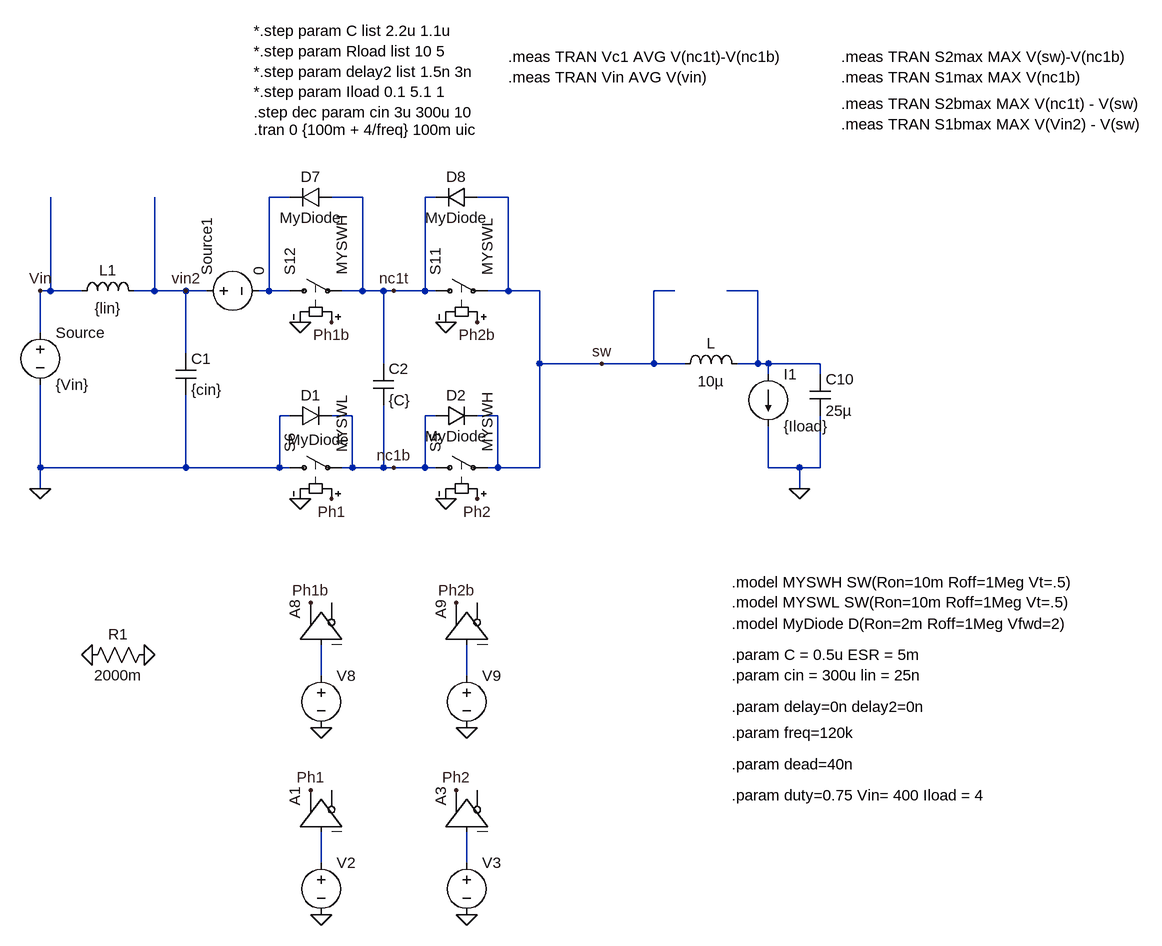
[diagram p0: schematic 3level_input_cap.asc]
3level_input_cap.asc, the LTspice schematic file:
Version 4
SHEET 1 1904 1428
WIRE -1152 -64 -1184 -64
WIRE -1040 -64 -1088 -64
WIRE -928 -64 -944 -64
WIRE -816 -64 -864 -64
WIRE -1520 80 -1520 -64
WIRE -1520 80 -1536 80
WIRE -1472 80 -1520 80
WIRE -1360 80 -1360 -64
WIRE -1360 80 -1392 80
WIRE -1312 80 -1360 80
WIRE -1280 80 -1312 80
WIRE -1184 80 -1184 -64
WIRE -1184 80 -1200 80
WIRE -1152 80 -1184 80
WIRE -1040 80 -1040 -64
WIRE -1040 80 -1072 80
WIRE -1008 80 -1040 80
WIRE -992 80 -1008 80
WIRE -944 80 -944 -64
WIRE -944 80 -992 80
WIRE -928 80 -944 80
WIRE -816 80 -816 -64
WIRE -816 80 -848 80
WIRE -768 80 -816 80
WIRE -560 80 -592 80
WIRE -432 80 -480 80
WIRE -1536 144 -1536 80
WIRE -1312 176 -1312 80
WIRE -1008 192 -1008 80
WIRE -768 192 -768 80
WIRE -672 192 -768 192
WIRE -592 192 -592 80
WIRE -592 192 -672 192
WIRE -544 192 -592 192
WIRE -432 192 -432 80
WIRE -432 192 -464 192
WIRE -416 192 -432 192
WIRE -336 192 -416 192
WIRE -416 208 -416 192
WIRE -336 208 -336 192
WIRE -1152 272 -1168 272
WIRE -1056 272 -1088 272
WIRE -928 272 -944 272
WIRE -832 272 -864 272
WIRE -1536 352 -1536 224
WIRE -1312 352 -1312 240
WIRE -1312 352 -1536 352
WIRE -1168 352 -1168 272
WIRE -1168 352 -1312 352
WIRE -1152 352 -1168 352
WIRE -1056 352 -1056 272
WIRE -1056 352 -1072 352
WIRE -1008 352 -1008 256
WIRE -1008 352 -1056 352
WIRE -992 352 -1008 352
WIRE -944 352 -944 272
WIRE -944 352 -992 352
WIRE -928 352 -944 352
WIRE -832 352 -832 272
WIRE -832 352 -848 352
WIRE -768 352 -768 192
WIRE -768 352 -832 352
WIRE -416 352 -416 288
WIRE -368 352 -416 352
WIRE -336 352 -336 272
WIRE -336 352 -368 352
WIRE -1536 384 -1536 352
WIRE -368 384 -368 352
WIRE -1104 672 -1104 624
WIRE -880 672 -880 624
WIRE -1104 960 -1104 912
WIRE -880 960 -880 912
FLAG -1104 1040 0
FLAG -1120 848 Ph1
FLAG -1536 80 Vin
FLAG -864 128 Ph2b
FLAG -1088 128 Ph1b
FLAG -1136 128 0
FLAG -912 128 0
FLAG -880 1040 0
FLAG -896 848 Ph2
FLAG -864 400 Ph2
FLAG -1088 400 Ph1
FLAG -1136 400 0
FLAG -912 400 0
FLAG -368 384 0
FLAG -1536 384 0
FLAG -1104 752 0
FLAG -1120 560 Ph1b
FLAG -880 752 0
FLAG -896 560 Ph2b
FLAG -992 80 nc1t
FLAG -992 352 nc1b
FLAG -672 192 sw
FLAG -1312 80 vin2
FLAG -1456 640 0
FLAG -1376 640 0
SYMBOL voltage -1104 944 R0
WINDOW 123 0 0 Left 2
WINDOW 39 0 0 Left 2
WINDOW 3 24 96 Invisible 2
SYMATTR Value PULSE(0 1 0 1p 1p {1/freq*(1-duty)} {1/freq})
SYMATTR InstName V2
SYMBOL Digital\\buf -1168 912 R270
SYMATTR InstName A1
SYMBOL voltage -1536 128 R0
WINDOW 123 0 0 Left 2
WINDOW 39 0 0 Left 2
SYMATTR InstName Source
SYMATTR Value {Vin}
SYMBOL sw -944 80 R270
SYMATTR InstName S11
SYMATTR Value MYSWL
SYMBOL sw -1168 80 R270
SYMATTR InstName S12
SYMATTR Value MYSWH
SYMBOL voltage -880 944 R0
WINDOW 123 0 0 Left 2
WINDOW 39 0 0 Left 2
WINDOW 3 24 96 Invisible 2
SYMATTR Value PULSE(0 1 {1/freq/2+delay} 1p 1p {1/freq*(1-duty)-delay+delay2} {1/freq})
SYMATTR InstName V3
SYMBOL Digital\\buf -944 912 R270
SYMATTR InstName A3
SYMBOL sw -944 352 R270
SYMATTR InstName S5
SYMATTR Value MYSWH
SYMBOL sw -1168 352 R270
SYMATTR InstName S6
SYMATTR Value MYSWL
SYMBOL cap -1024 192 R0
SYMATTR InstName C2
SYMATTR Value {C}
SYMATTR SpiceLine Rser={ESR}
SYMATTR SpiceLine2 IC={Vin/2}
SYMBOL ind -560 208 R270
WINDOW 0 32 56 VTop 2
WINDOW 3 5 56 VBottom 2
SYMATTR InstName L
SYMATTR Value 10µ
SYMATTR SpiceLine Rser=20m
SYMATTR SpiceLine2 ic = {Iload}
SYMBOL cap -352 208 R0
SYMATTR InstName C10
SYMATTR Value 25µ
SYMATTR SpiceLine IC={Vin*duty}
SYMATTR SpiceLine2 Rser=1m
SYMBOL voltage -1104 656 R0
WINDOW 123 0 0 Left 2
WINDOW 39 0 0 Left 2
WINDOW 3 24 96 Invisible 2
SYMATTR Value PULSE(0 1 {1/freq*(1-duty)+dead+delay} 1p 1p {1/freq*duty-dead*2-delay+delay2} {1/freq})
SYMATTR InstName V8
SYMBOL Digital\\buf -1168 624 R270
SYMATTR InstName A8
SYMBOL voltage -880 656 R0
WINDOW 123 0 0 Left 2
WINDOW 39 0 0 Left 2
WINDOW 3 24 96 Invisible 2
SYMATTR Value PULSE(0 1 {1/freq/2+1/freq*(1-duty)+dead} 1p 1p {1/freq*duty-dead*2} {1/freq})
SYMATTR InstName V9
SYMBOL Digital\\buf -944 624 R270
SYMATTR InstName A9
SYMBOL diode -1152 288 R270
WINDOW 0 32 32 VTop 2
WINDOW 3 -5 44 VBottom 2
SYMATTR InstName D1
SYMATTR Value MyDiode
SYMBOL diode -928 288 R270
WINDOW 0 32 32 VTop 2
WINDOW 3 0 32 VBottom 2
SYMATTR InstName D2
SYMATTR Value MyDiode
SYMBOL diode -1088 -80 R90
WINDOW 0 0 32 VBottom 2
WINDOW 3 32 32 VTop 2
SYMATTR InstName D7
SYMATTR Value MyDiode
SYMBOL diode -864 -80 R90
WINDOW 0 0 32 VBottom 2
WINDOW 3 32 32 VTop 2
SYMATTR InstName D8
SYMATTR Value MyDiode
SYMBOL current -416 208 R0
WINDOW 123 0 0 Left 2
WINDOW 39 0 0 Left 2
SYMATTR InstName I1
SYMATTR Value {Iload}
SYMBOL cap -1328 176 R0
SYMATTR InstName C1
SYMATTR Value {cin}
SYMATTR SpiceLine Rser=2m ic = {vin}
SYMBOL res -1472 656 R270
WINDOW 0 32 56 VTop 2
WINDOW 3 0 56 VBottom 2
SYMATTR InstName R1
SYMATTR Value 2000m
SYMBOL ind -1488 96 R270
WINDOW 0 32 56 VTop 2
WINDOW 3 5 56 VBottom 2
SYMATTR InstName L1
SYMATTR Value {lin}
SYMATTR SpiceLine Rser=10m
SYMBOL voltage -1296 80 R270
WINDOW 123 0 0 Left 2
WINDOW 39 0 0 Left 2
SYMATTR InstName Source1
SYMATTR Value 0
TEXT -1208 -168 Left 2 !.tran 0 {100m + 4/freq} 100m uic
TEXT -472 528 Left 2 !.model MYSWH SW(Ron=10m Roff=1Meg Vt=.5)\n.model MYSWL SW(Ron=10m Roff=1Meg Vt=.5)
TEXT -472 592 Left 2 !.model MyDiode D(Ron=2m Roff=1Meg Vfwd=2)
TEXT -472 720 Left 2 !.param delay=0n delay2=0n
TEXT -472 760 Left 2 !.param freq=120k
TEXT -472 856 Left 2 !.param duty=0.75 Vin= 400 Iload = 4
TEXT -472 808 Left 2 !.param dead=40n
TEXT -472 640 Left 2 !.param C = 0.5u ESR = 5m \n.param cin = 300u lin = 25n
TEXT -304 -280 Left 2 !.meas TRAN S2max MAX V(sw)-V(nc1b)\n.meas TRAN S1max MAX V(nc1b)
TEXT -816 -280 Left 2 !.meas TRAN Vc1 AVG V(nc1t)-V(nc1b)\n.meas TRAN Vin AVG V(vin)
TEXT -304 -208 Left 2 !.meas TRAN S2bmax MAX V(nc1t) - V(sw)\n.meas TRAN S1bmax MAX V(Vin2) - V(sw)
TEXT -1208 -320 Left 2 !*.step param C list 2.2u 1.1u\n*.step param Rload list 10 5\n*.step param delay2 list 1.5n 3n\n*.step param Iload 0.1 5.1 1\n.step dec param cin 3u 300u 10

The netlist it stands for:
* 3level_input_cap.asc
V2 N005 0 PULSE(0 1 0 1p 1p {1/freq*(1-duty)} {1/freq})
A1 N005 0 0 0 0 0 Ph1 0 BUF
V§Source Vin 0 {Vin}
S11 nc1t sw Ph2b 0 MYSWL
S12 N001 nc1t Ph1b 0 MYSWH
V3 N006 0 PULSE(0 1 {1/freq/2+delay} 1p 1p {1/freq*(1-duty)-delay+delay2} {1/freq})
A3 N006 0 0 0 0 0 Ph2 0 BUF
S5 nc1b sw Ph2 0 MYSWH
S6 0 nc1b Ph1 0 MYSWL
C2 nc1t nc1b {C} Rser={ESR} IC={Vin/2}
L sw N002 10µ Rser=20m ic = {Iload}
C10 N002 0 25µ IC={Vin*duty} Rser=1m
V8 N003 0 PULSE(0 1 {1/freq*(1-duty)+dead+delay} 1p 1p {1/freq*duty-dead*2-delay+delay2} {1/freq})
A8 N003 0 0 0 0 0 Ph1b 0 BUF
V9 N004 0 PULSE(0 1 {1/freq/2+1/freq*(1-duty)+dead} 1p 1p {1/freq*duty-dead*2} {1/freq})
A9 N004 0 0 0 0 0 Ph2b 0 BUF
D1 0 nc1b MyDiode
D2 nc1b sw MyDiode
D7 nc1t N001 MyDiode
D8 sw nc1t MyDiode
I1 N002 0 {Iload}
C1 vin2 0 {cin} Rser=2m ic = {vin}
R1 0 0 2000m
L1 Vin vin2 {lin} Rser=10m
V§Source1 vin2 N001 0
.model D D
.lib standard.dio
.tran 0 {100m + 4/freq} 100m uic
.model MYSWH SW(Ron=10m Roff=1Meg Vt=.5)
.model MYSWL SW(Ron=10m Roff=1Meg Vt=.5)
.model MyDiode D(Ron=2m Roff=1Meg Vfwd=2)
.param delay=0n delay2=0n
.param freq=120k
.param duty=0.75 Vin= 400 Iload = 4
.param dead=40n
.param C = 0.5u ESR = 5m
.param cin = 300u lin = 25n
.meas TRAN S2max MAX V(sw)-V(nc1b)
.meas TRAN S1max MAX V(nc1b)
.meas TRAN Vc1 AVG V(nc1t)-V(nc1b)
.meas TRAN Vin AVG V(vin)
.meas TRAN S2bmax MAX V(nc1t) - V(sw)
.meas TRAN S1bmax MAX V(Vin2) - V(sw)
*.step param C list 2.2u 1.1u
*.step param Rload list 10 5
*.step param delay2 list 1.5n 3n
*.step param Iload 0.1 5.1 1
.step dec param cin 3u 300u 10
.backanno
.end